# Altium schematic sheet Power.SchDoc
size 393 x 350 mm; SheetNumber: 2; SheetTotal: 7
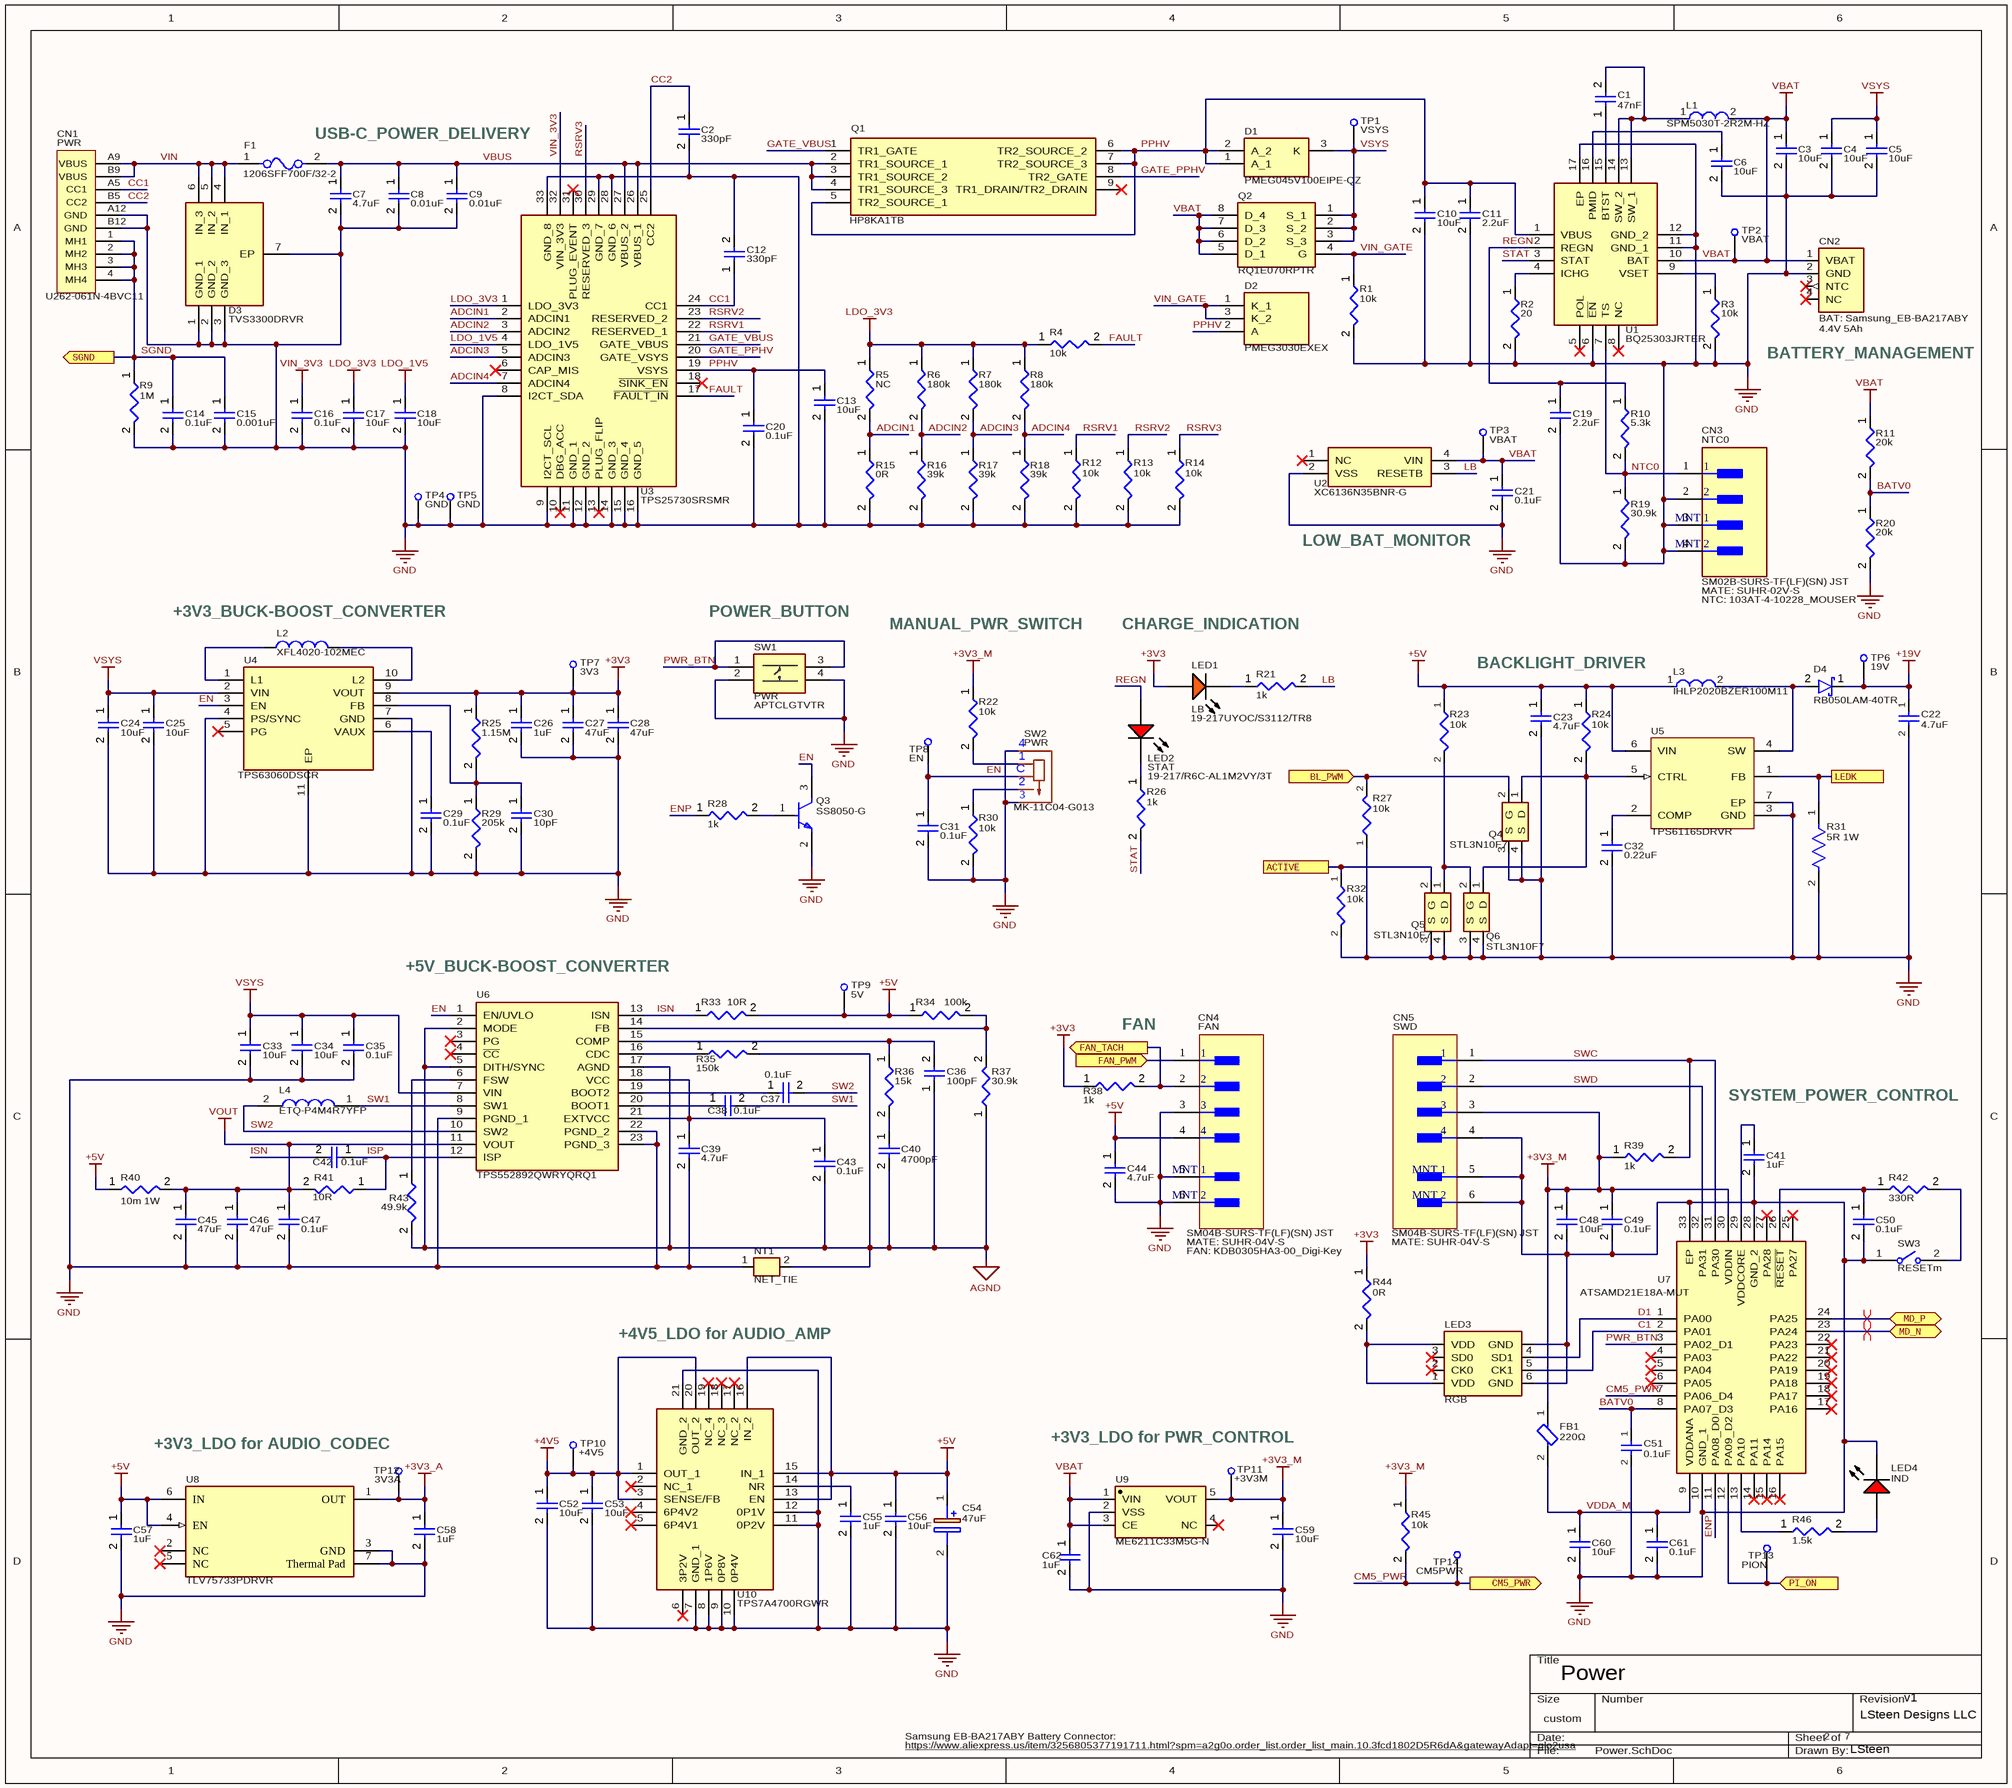
[diagram p0: Power.SchDoc]

## Parts
C1  47nF  [CAPC1005X56X25LL10T15]
C2  330pF  [CAPC1005X56X25LL10T15]
C3  10uF  [CAPC0805(2012)145_L]
C4  10uF  [CAPC0805(2012)145_L]
C5  10uF  [CAPC0805(2012)145_L]
C6  10uF  [CAPC0805(2012)145_L]
C7  4.7uF  [CAPC0603(1608)100_L]
C8  0.01uF  [CAPC1005X56X25LL10T15]
C9  0.01uF  [CAPC1005X56X25LL10T15]
C10  10uF  [CAPC0805(2012)145_L]
C11  2.2uF  [CAPC0603(1608)100_L]
C12  330pF  [CAPC1005X56X25LL10T15]
C13  10uF  [CAPC0603(1608)100_L]
C14  0.1uF  [CAPC1005X56X25LL10T15]
C15  0.001uF  [CAPC1005X56X25LL10T15]
C16  0.1uF  [CAPC1005X56X25LL10T15]
C17  10uF  [CAPC0603(1608)100_L]
C18  10uF  [CAPC0603(1608)100_L]
C19  2.2uF  [CAPC1005X56X25LL10T15]
C20  0.1uF  [CAPC1005X56X25LL10T15]
C21  0.1uF  [CAPC1005X56X25LL10T15]
C22  4.7uF  [CAPC2012X140N]
C23  4.7uF  [CAPC0805(2012)145_L]
C24  10uF  [CAPC0603(1608)100_L]
C25  10uF  [CAPC0603(1608)100_L]
C26  1uF  [CAPC1005X56X25LL10T15]
C27  47uF  [CAPC0805(2012)145_L]
C28  47uF  [CAPC0805(2012)145_L]
C29  0.1uF  [CAPC1005X56X25LL10T15]
C30  10pF  [CAPC1005X56X25LL10T15]
C31  0.1uF  [CAPC1005X56X25LL10T15]
C32  0.22uF  [CAPC1005X56X25LL10T15]
C33  10uF  [CAPC0805(2012)145_L]
C34  10uF  [CAPC0805(2012)145_L]
C35  0.1uF  [CAPC1005X56X25LL10T15]
C36  100pF  [CAPC1005X56X25LL10T15]
C37  0.1uF  [CAPC1005X56X25LL10T15]
C38  0.1uF  [CAPC1005X56X25LL10T15]
C39  4.7uF  [CAPC0603(1608)100_L]
C40  4700pF  [CAPC1005X56X25LL10T15]
C41  1uF  [CAPC1005X56X25LL10T15]
C42  0.1uF  [CAPC1005X56X25LL10T15]
C43  0.1uF  [CAPC1005X56X25LL10T15]
C44  4.7uF  [CAPC0805(2012)145_L]
C45  47uF  [CAPC0805(2012)145_L]
C46  47uF  [CAPC0805(2012)145_L]
C47  0.1uF  [CAPC1005X56X25LL10T15]
C48  10uF  [CAPC0603(1608)100_L]
C49  0.1uF  [CAPC1005X56X25LL10T15]
C50  0.1uF  [CAPC1005X56X25LL10T15]
C51  0.1uF  [CAPC1005X55N]
C52  10uF  [CAPC0805(2012)145_L]
C53  10uF  [CAPC0805(2012)145_L]
C54  47uF  [CAPPM2014X140N]
C55  1uF  [CAPC0603(1608)100_L]
C56  10uF  [CAPC0805(2012)145_L]
C57  1uF  [CAPC0603(1608)100_L]
C58  1uF  [CAPC0603(1608)100_L]
C59  10uF  [CAPC0603(1608)100_L]
C60  10uF  [CAPC0603(1608)100_L]
C61  0.1uF  [CAPC1005X56X25LL10T15]
C62  1uF  [CAPC0603(1608)100_L]
CN1  PWR  [USB-SMD_U262-061N-4BVC11]
CN2  BAT  [BAT_SS_EB-BA217ABY_BRD]  (value not drawn)
CN3  NTC0  [FP-SM02B-SURS-TF_LF_SN-MFG]
CN4  FAN  [FP-SM04B-SURS-TF_LF_SN-MFG]
CN5  SWD  [FP-SM04B-SURS-TF_LF_SN-MFG]
D1  PMEG045V100EIPE-QZ  [PMEG045V100EIPEQZ]
D2  PMEG3030EXEX  [PMEG4010EXEX]
D3  TVS3300DRVR  [SON65P200X200X80-7N]
D4  RB050LAM-40TR  [SODFL4725X105N]
F1  1206SFF700F/32-2  [FP-1206SFF-MFG]
FB1  220Ω  [FP-BLM18-0_15-t0_5-IPC_B]
L1  SPM5030T-2R2M-HZ  [FP-SPM5030-MFG]
L2  XFL4020-102MEC  [COIL-XFL4020_V]
L3  IHLP2020BZER100M11  [FP-IHLP-2020BZ-FP_1_905x2-MFG]
L4  ETQ-P4M4R7YFP  [ETQP3M_4M_YFP]
LED1  LB  [LED_0603]
LED2  STAT  [EVRL-0603-2_V]
LED3  RGB  [AP102-2020]
LED4  IND  [EVRL-0603-2_V]
NT1  NET_TIE  [NET_TIE1]  (net tie, no BOM)
Q1  HP8KA1TB  [HP8KA1TB]
Q2  RQ1E070RPTR  [RQ1E070RPTR]
Q3  SS8050-G  [FP-SS8050-G-MFG]
Q4  STL3N10F7  [STL3N10F7]
Q5  STL3N10F7  [STL3N10F7]
Q6  STL3N10F7  [STL3N10F7]
R1  10k  [RESC0402(1005)_L]
R2  20  [RESC0402(1005)_L]
R3  10k  [RESC0402(1005)_L]
R4  10k  [RESC0402(1005)_L]
R5  NC  [RESC0402(1005)_L]
R6  180k  [RESC0402(1005)_L]
R7  180k  [RESC0402(1005)_L]
R8  180k  [RESC0402(1005)_L]
R9  1M  [RESC0402(1005)_L]
R10  5.3k  [RESC0402(1005)_L]
R11  20k  [RESC0402(1005)_L]
R12  10k  [RESC0402(1005)_L]
R13  10k  [RESC0402(1005)_L]
R14  10k  [RESC0402(1005)_L]
R15  0R  [RESC0402(1005)_L]
R16  39k  [RESC0402(1005)_L]
R17  39k  [RESC0402(1005)_L]
R18  39k  [RESC0402(1005)_L]
R19  30.9k  [RESC0402(1005)_L]
R20  20k  [RESC0402(1005)_L]
R21  1k  [RESC0402(1005)_L]
R22  10k  [RESC0402(1005)_L]
R23  10k  [ERA2AED122X]
R24  10k  [RESC0402(1005)_L]
R25  1.15M  [RESC0402(1005)_L]
R26  1k  [RESC0402(1005)_L]
R27  10k  [ERA2AED122X]
R28  1k  [RESC0402(1005)_L]
R29  205k  [RESC0402(1005)_L]
R30  10k  [RESC0402(1005)_L]
R31  5R 1W  [FP-CRCW2512-e3-MFG]
R32  10k  [ERA2AED122X]
R33  10R  [RESC0402(1005)_L]
R34  100k  [RESC0402(1005)_L]
R35  150k  [RESC0402(1005)_L]
R36  15k  [RESC0402(1005)_L]
R37  30.9k  [RESC0402(1005)_L]
R38  1k  [RESC0402(1005)_L]
R39  1k  [RESC0402(1005)_L]
R40  10m 1W  [RESC3216X60X45ML15T20]
R41  10R  [RESC0402(1005)_L]
R42  330R  [RESC0402(1005)_L]
R43  49.9K  [RESC0402(1005)_L]
R44  0R  [RESC0402(1005)_L]
R45  10k  [RESC0402(1005)_L]
R46  1.5k  [RESC0402(1005)_L]
SW1  PWR  [APTCLGTVTR]
SW2  PWR  [SW-SMD_MK-11C04-G013]
SW3  RESETm  [FP-B3U-1000P-MFG]
TP1  VSYS  [TP]  (no BOM)
TP2  VBAT  [TP]  (no BOM)
TP3  VBAT  [TP]  (no BOM)
TP4  GND  [TP]  (no BOM)
TP5  GND  [TP]  (no BOM)
TP6  19V  [TP]  (no BOM)
TP7  3V3  [TP]  (no BOM)
TP8  EN  [TP]  (no BOM)
TP9  5V  [TP]  (no BOM)
TP10  +4V5  [TP]  (no BOM)
TP11  +3V3M  [TP]  (no BOM)
TP12  3V3A  [TP]  (no BOM)
TP13  PION  [TP]  (no BOM)
TP14  CM5PWR  [TP]  (no BOM)
U1  BQ25303JRTER  [QFN50P300X300X80-17N-D]
U2  XC6136N35BNR-G  [XC6136C12ANRG]
U3  TPS25730SRSMR  [QFN40P400X400X100-33N-D]
U4  TPS63060DSCR  [SON50P300X300X80-11N-D]
U5  TPS61165DRVR  [DRV0006A_V]
U6  TPS552892QWRYQRQ1  [TPS552892QWRYQRQ1]
U7  ATSAMD21E18A-MUT  [QFN50P500X500X90-33N-D]
U8  TLV75733PDRVR  [FP-DRV0006A-IPC_B]
U9  ME6211C33M5G-N  [SOT95P270X145-5N]
U10  TPS7A4700RGWR  [QFN65P500X500X100-21N-D]

## Ports
ACTIVE (see Display[4B]), BL_PWM (in, see Module A IO[6B]), CM5_PWR (out, see Module A IO[4A]), FAN_PWM (in, see Module A IO[5B]), FAN_TACH (out, see Module A IO[5B]), LEDK (see Display[2A]), MD_N (bidir, see USB[2D]), MD_P (bidir, see USB[2D]), PI_ON (in, see Module A IO[5B]), SGND (out, see Module B High-Speed[6C])

## Nets
+3V3: C26.1 C27.1 C28.1 LED1.1(A) R25.1 R38.1 R44.1 TP7.1 U4.9(VOUT)
+3V3_A: C58.1 TP12.1 U8.1(OUT)
+3V3_M: C48.1 C49.1 C59.1 CN5.3 FB1.1 R22.1 R39.1 R45.1 TP11.1 U7.30(VDDIN) U9.5(VOUT)
+4V5: C52.1 C53.1 TP10.1 U10.1(OUT_1) U10.3(SENSE/FB) U10.20(OUT_2)
+5V: C23.1 C44.1 C54.1(+) C56.1 C57.1 CN4.4 L3.1 R23.1 R24.1 R33.2 R34.1 R40.1 TP9.1 U5.6(VIN) U8.4(EN) U8.6(IN) U10.13(EN) U10.15(IN_1) U10.16(IN_2)
+19V: C22.1 D4.1 TP6.1
AGND: C36.1 C40.2 C43.2 NT1.2 R35.2 R37.1 R43.2 U6.2(MODE) U6.5(DITH/SYNC) U6.17(AGND)
GND: C2.2 C3.2 C4.2 C5.2 C6.2 C7.2 C8.2 C9.2 C10.2 C11.2 C12.2 C13.2 C14.2 C15.2 C16.2 C17.2 C18.2 C19.2 C20.2 C21.2 C22.2 C23.2 C24.2 C25.2 C26.2 C27.2 C28.2 C29.2 C30.2 C31.2 C32.2 C33.2 C34.2 C35.2 C39.2 C41.2 C44.2 C45.2 C46.2 C47.2 C48.2 C49.2 C50.2 C51.2 C52.2 C53.2 C54.2(-) C55.2 C56.2 C57.2 C58.2 C59.2 C60.2 C61.2 C62.2 CN1.A12(GND) CN1.B12(GND) CN2.2(GND) CN3.2 CN3.3(MNT_1) CN3.4(MNT_2) CN4.3 CN4.5(MNT_1) CN4.6(MNT_2) CN5.4 CN5.5(MNT_1) CN5.6(MNT_2) D3.1(GND_1) D3.2(GND_2) D3.3(GND_3) D3.7(EP) LED3.6(GND) LED3.8(GND) LED4.2(K) NT1.1 Q3.2(E) Q4.3(S) Q4.4(S) Q5.3(S) Q5.4(S) Q6.3(S) Q6.4(S) R1.2 R2.2 R3.2 R9.2 R12.2 R13.2 R14.2 R15.2 R16.2 R17.2 R18.2 R19.2 R20.2 R27.1 R29.2 R30.2 R31.2 R32.2 SW1.2 SW1.4 SW2.3(NC) SW2.4 SW3.1 TP4.1 TP5.1 U1.6(~{EN}) U1.11(GND_1) U1.12(GND_2) U1.17(EP) U2.2(VSS) U3.8(I2CT_SDA) U3.9(I2CT_SCL) U3.11(GND_1) U3.12(GND_2) U3.14(GND_3) U3.15(GND_4) U3.16(GND_5) U3.28(GND_6) U3.29(GND_7) U3.33(GND_8) U4.4(PS/SYNC) U4.7(GND) U4.11(EP) U5.3(GND) U5.7(EP) U6.9(PGND_1) U6.22(PGND_2) U6.23(PGND_3) U7.10(GND_1) U7.28(GND_2) U7.33(EP) U8.3(GND) U8.7(Thermal_Pad) U9.2(VSS) U10.7(GND_1) U10.8(1P6V) U10.9(0P8V) U10.10(0P4V) U10.11(0P2V) U10.12(0P1V) U10.21(GND_2)
LDO_1V5: C18.1 U3.4(LDO_1V5)
LDO_3V3: C17.1 R4.1 R5.1 R6.1 R7.1 R8.1 U3.1(LDO_3V3)
VBAT: C3.1 C21.1 C62.1 CN2.1(VBAT) L1.2 Q2.5(D_1) Q2.6(D_2) Q2.7(D_3) Q2.8(D_4) R11.1 TP2.1 TP3.1 U1.10(BAT) U2.4(VIN) U9.1(VIN) U9.3(CE)
VIN_3V3: C16.1 U3.32(VIN_3V3)
VOUT: C45.1 C46.1 C47.1 R40.2 R41.2 U6.11(VOUT)
VSYS: C4.1 C5.1 C24.1 C25.1 C33.1 C34.1 C35.1 D1.3(K) Q2.1(S_1) Q2.2(S_2) Q2.3(S_3) TP1.1 U4.2(VIN) U6.7(VIN)
ACTIVE: Q5.2(G) R32.1 ; port ACTIVE
ADCIN1: R5.2 R15.1 U3.2(ADCIN1)
ADCIN2: R6.2 R16.1 U3.3(ADCIN2)
ADCIN3: R7.2 R17.1 U3.5(ADCIN3)
ADCIN4: R8.2 R18.1 U3.7(ADCIN4)
BATV0: C51.1 R11.2 R20.1 U7.8(PA07_D3)
BL_PWM: Q4.2(G) R27.2 ; port BL_PWM
C1: LED3.5(CK1) U7.2(PA01)
CC1: C12.1 CN1.A5(CC1) U3.24(CC1)
CC2: C2.1 CN1.B5(CC2) U3.25(CC2)
CM5_PWR: R45.2 TP14.1 U7.7(PA06_D4) ; port CM5_PWR
D1: LED3.4(SD1) U7.1(PA00)
EN: C31.1 Q3.3(C) SW2.C TP8.1 U4.3(EN) U6.1(EN/UVLO)
ENP: R28.1 U7.11(PA08_D0)
FAN_PWM: CN4.1 ; port FAN_PWM
FAN_TACH: CN4.2 R38.2 ; port FAN_TACH
FAULT: R4.2 U3.17(~{FAULT_IN})
GATE_PPHV: Q1.8(TR2_GATE) U3.20(GATE_VSYS)
GATE_VBUS: Q1.1(TR1_GATE) U3.21(GATE_VBUS)
ISN: C42.2 R33.1 U6.13(ISN)
ISP: C42.1 R41.1 U6.12(ISP)
LB: R21.2 U2.3(RESETB)
LEDK: R31.1 U5.1(FB) ; port LEDK
MD_N: U7.23(PA24) ; port MD_N
MD_P: U7.24(PA25) ; port MD_P
NTC0: CN3.1 R10.2 R19.1 U1.7(TS)
PI_ON: TP13.1 U7.12(PA09_D2) ; port PI_ON
PPHV: C10.1 C11.1 C13.1 C20.1 D1.1(A_1) D1.2(A_2) D2.2(A) Q1.5(TR2_SOURCE_1) Q1.6(TR2_SOURCE_2) Q1.7(TR2_SOURCE_3) U1.1(VBUS) U3.19(VSYS)
PWR_BTN: SW1.1 SW1.3 U7.3(PA02_D1)
REGN: C19.1 LED2.1(A) R10.1 U1.2(REGN)
RSRV1: R12.1 U3.22(RESERVED_1)
RSRV2: R13.1 U3.23(RESERVED_2)
RSRV3: R14.1 U3.30(RESERVED_3)
SGND: C14.1 C15.1 CN1.1(MH1) CN1.2(MH2) CN1.3(MH3) CN1.4(MH4) R9.1 ; port SGND
STAT: R26.2 U1.3(STAT)
SW1: C38.2 L4.1 U6.8(SW1)
SW2: C37.2 L4.2 U6.10(SW2)
SWC: CN5.1 R39.2 U7.31(PA30)
SWD: CN5.2 U7.32(PA31)
VBUS: C7.1 C8.1 C9.1 F1.2 Q1.2(TR1_SOURCE_1) Q1.3(TR1_SOURCE_2) Q1.4(TR1_SOURCE_3) U3.26(VBUS_1) U3.27(VBUS_2)
VDDA_M: C60.1 C61.1 FB1.2 U7.9(VDDANA)
VIN: CN1.A9(VBUS) CN1.B9(VBUS) D3.4(IN_1) D3.5(IN_2) D3.6(IN_3) F1.1
VIN_GATE: D2.1(K_1) D2.3(K_2) Q2.4(G) R1.1
NetC1_1: C1.1 U1.15(BTST)
NetC1_2: C1.2 L1.1 U1.13(SW_1) U1.14(SW_2)
NetC6_1: C6.1 U1.16(PMID)
NetC29_1: C29.1 U4.6(VAUX)
NetC30_1: C30.1 R25.2 R29.1 U4.8(FB)
NetC32_1: C32.1 U5.2(COMP)
NetC36_2: C36.2 R36.1 U6.15(COMP)
NetC37_1: C37.1 U6.19(BOOT2)
NetC38_1: C38.1 U6.20(BOOT1)
NetC39_1: C39.1 C43.1 U6.18(VCC) U6.21(EXTVCC)
NetC40_1: C40.1 R36.2
NetC41_1: C41.1 U7.29(VDDCORE)
NetC50_1: C50.1 R42.1 U7.26(~{RESET})
NetC55_1: C55.1 U10.14(NR)
NetD4_2: D4.2 L3.2 U5.4(SW)
NetL2_1: L2.1 U4.1(L1)
NetL2_2: L2.2 U4.10(L2)
NetLED1_2: LED1.2(K) R21.1
NetLED2_2: LED2.2(K) R26.1
NetLED3_1: LED3.1(VDD) LED3.7(VDD) R44.2
NetLED4_1: LED4.1(A) R46.2
NetQ3_1: Q3.1(B) R28.2
NetQ4_1: Q4.1(D) Q6.1(D) R24.2 U5.5(CTRL)
NetQ5_1: Q5.1(D) Q6.2(G) R23.2
NetR2_1: R2.1 U1.4(ICHG)
NetR3_1: R3.1 U1.9(VSET)
NetR22_2: R22.2 SW2.1
NetR30_1: R30.1 SW2.2
NetR34_2: R34.2 R37.2 U6.14(FB)
NetR35_1: R35.1 U6.16(CDC)
NetR42_2: R42.2 SW3.2
NetR43_1: R43.1 U6.6(FSW)
NetR46_1: R46.1 U7.13(PA10)

Not connected (* = marked no-connect by the designer): CN2 3(NTC)* 4(NC)*; LED3 2(CK0)* 3(SD0)*; Q1 9(TR1_DRAIN/TR2_DRAIN)*; U1 5(POL)* 8(NC)*; U2 1(NC)*; U3 6(CAP_MIS)* 10(DBG_ACC)* 13(PLUG_FLIP)* 18(~{SINK_EN})* 31(PLUG_EVENT)*; U4 5(PG)*; U6 3(PG)* 4(~{CC})*; U7 4(PA03)* 5(PA04)* 6(PA05)* 14(PA11)* 15(PA14)* 16(PA15)* 17(PA16)* 18(PA17)* 19(PA18)* 20(PA19)* 21(PA22)* 22(PA23)* 25(PA27)* 27(PA28)*; U8 2(NC)* 5(NC)*; U9 4(NC)*; U10 2(NC_1)* 4(6P4V2)* 5(6P4V1)* 6(3P2V)* 17(NC_2)* 18(NC_3)* 19(NC_4)*

## Layout directives
differential pair; differential pair class USB 2.0: MD_N, MD_P

## Notes on the sheet
- (near F1) USB-C_POWER_DELIVERY
- (near CN1) U262-061N-4BVC11
- (near CN2) BAT: Samsung_EB-BA217ABY
- BATTERY_MANAGEMENT
- (near CN2) 4.4V 5Ah
- LOW_BAT_MONITOR
- (near CN3) SM02B-SURS-TF(LF)(SN) JST
- (near L2) +3V3_BUCK-BOOST_CONVERTER
- (near SW1) POWER_BUTTON
- MANUAL_PWR_SWITCH
- CHARGE_INDICATION
- NTC: 103AT-4-10228_MOUSER
- (near CN3) MATE: SUHR-02V-S
- (near SW1) APTCLGTVTR
- BACKLIGHT_DRIVER
- (near R26) 19-217/R6C-AL1M2VY/3T
- 19-217UYOC/S3112/TR8
- (near SW2) MK-11C04-G013
- (near U6) +5V_BUCK-BOOST_CONVERTER
- FAN
- (near C41) SYSTEM_POWER_CONTROL
- FAN: KDB0305HA3-00_Digi-Key
- (near CN4) MATE: SUHR-04V-S
- (near CN4) SM04B-SURS-TF(LF)(SN) JST
- MATE: SUHR-04V-S
- (near CN5) SM04B-SURS-TF(LF)(SN) JST
- +4V5_LDO for AUDIO_AMP
- +3V3_LDO for AUDIO_CODEC
- (near TP11) +3V3_LDO for PWR_CONTROL
- Power
- Samsung EB-BA217ABY Battery Connector:
- 2
- 7
- LSteen Designs LLC
- v1
- https://www.aliexpress.us/item/3256805377191711.html?spm=a2g0o.order_list.order_list_main.10.3fcd1802D5R6dA&gatewayAdapt=glo2usa
- LSteen

## Library data of the parts
C1 = CMP-001-00001-6: Chip Capacitor, 47 nF, +/- 5%, 16 V, 0402 (1005 Metric); Capacitor Type: Ceramic; Voltage Rating: 16V; Max Operating Temperature: 125°C; Min Operating Temperature: -55°C; Case/Package: 0402; Value: 47nF; Mounting Technology: SM; Pins: 2; Tolerance: 5%; RoHS Compliant: True
C2 C12 = CMP-001-00001-6: Chip Capacitor, 330pF, +/- 5%, 16 V, 0402 (1005 Metric); Capacitor Type: Ceramic; Voltage Rating: 16V; Max Operating Temperature: 125°C; Min Operating Temperature: -55°C; Case/Package: 0402; Value: 330pF; Mounting Technology: SM; Pins: 2; Tolerance: 5%; RoHS Compliant: True
C3-C6 C10 C33 C34 C52 C53 C56 = CMP-001-00079-4: Chip Capacitor, 10µF +/-20%, 25V, 0805, Thickness 1.45 mm; Tolerance: 10%; Max Operating Temperature: 85°C; Value: 10µF; Case/Package: 0805; Voltage Rating: 25V; Min Operating Temperature: -55°C; Mounting Technology: SMT; Pins: 2
C7 = CMP-001-00076-4: Chip Capacitor, 4.7uF +/-20%, 10V, 0603, Thickness 1 mm; Tolerance: 10%; Mounting Technology: SMT; Case/Package: 0603; Pins: 2; Min Operating Temperature: -55°C; Max Operating Temperature: 85°C; Value: 4.7uF; Voltage Rating: 10V
C8 C9 = CMP-001-00001-6: Chip Capacitor, 0.01 uF, +/- 5%, 16 V, 0402 (1005 Metric); Capacitor Type: Ceramic; Voltage Rating: 16V; Max Operating Temperature: 125°C; Min Operating Temperature: -55°C; Case/Package: 0402; Value: 0.01uF; Mounting Technology: SM; Pins: 2; Tolerance: 5%; RoHS Compliant: True
C11 = CMP-001-00076-4: Chip Capacitor, 2.2uF +/-20%, 10V, 0603, Thickness 1 mm; Tolerance: 10%; Mounting Technology: SMT; Case/Package: 0603; Pins: 2; Min Operating Temperature: -55°C; Max Operating Temperature: 85°C; Value: 2.2uF; Voltage Rating: 10V
C13 C17 C18 C24 C25 C48 C59 C60 = CMP-001-00076-4: Chip Capacitor, 10uF +/-20%, 10V, 0603, Thickness 1 mm; Tolerance: 10%; Mounting Technology: SMT; Case/Package: 0603; Pins: 2; Min Operating Temperature: -55°C; Max Operating Temperature: 85°C; Value: 10uF; Voltage Rating: 10V
C14 C16 C20 C21 C29 C31 C35 C37 C38 C42 C43 C47 C49 C50 C61 = CMP-001-00001-6: Chip Capacitor, 0.1 uF, +/- 5%, 16 V, 0402 (1005 Metric); Capacitor Type: Ceramic; Voltage Rating: 16V; Max Operating Temperature: 125°C; Min Operating Temperature: -55°C; Case/Package: 0402; Value: 0.1uF; Mounting Technology: SM; Pins: 2; Tolerance: 5%; RoHS Compliant: True
C15 = CMP-001-00001-6: Chip Capacitor, 0.1 uF, +/- 5%, 16 V, 0402 (1005 Metric); Capacitor Type: Ceramic; Value: 0.1uF; Voltage Rating: 16V; Max Operating Temperature: 125°C; Min Operating Temperature: -55°C; Case/Package: 0402; Mounting Technology: SM; Pins: 2; Tolerance: 5%; RoHS Compliant: True
C19 = CMP-001-00001-6: Chip Capacitor, 2.2uF uF, +/- 5%, 16 V, 0402 (1005 Metric); Capacitor Type: Ceramic; Voltage Rating: 16V; Max Operating Temperature: 125°C; Min Operating Temperature: -55°C; Case/Package: 0402; Value: 2.2uF; Mounting Technology: SM; Pins: 2; Tolerance: 5%; RoHS Compliant: True
C22 = C0805: Height: 1.4mm
C23 C44 = CMP-001-00079-4: Chip Capacitor, 4.7µF +/-20%, 25V, 0805, Thickness 1.45 mm; Tolerance: 10%; Max Operating Temperature: 85°C; Value: 4.7µF; Case/Package: 0805; Voltage Rating: 25V; Min Operating Temperature: -55°C; Mounting Technology: SMT; Pins: 2
C26 C41 = CMP-001-00001-6: Chip Capacitor, 1 uF, +/- 5%, 16 V, 0402 (1005 Metric); Capacitor Type: Ceramic; Voltage Rating: 16V; Max Operating Temperature: 125°C; Min Operating Temperature: -55°C; Case/Package: 0402; Value: 1uF; Mounting Technology: SM; Pins: 2; Tolerance: 5%; RoHS Compliant: True
C27 C28 = CMP-001-00079-4: Chip Capacitor, 47µF +/-20%, 25V, 0805, Thickness 1.45 mm; Tolerance: 10%; Max Operating Temperature: 85°C; Value: 47µF; Case/Package: 0805; Voltage Rating: 25V; Min Operating Temperature: -55°C; Mounting Technology: SMT; Pins: 2
C30 = CMP-001-00001-6: Chip Capacitor, 10 pF, +/- 5%, 16 V, 0402 (1005 Metric); Capacitor Type: Ceramic; Voltage Rating: 16V; Max Operating Temperature: 125°C; Min Operating Temperature: -55°C; Case/Package: 0402; Value: 10pF; Mounting Technology: SM; Pins: 2; Tolerance: 5%; RoHS Compliant: True
C32 = CMP-001-00001-6: Chip Capacitor, 0.22 uF, +/- 5%, 16 V, 0402 (1005 Metric); Capacitor Type: Ceramic; Voltage Rating: 16V; Max Operating Temperature: 125°C; Min Operating Temperature: -55°C; Case/Package: 0402; Value: 0.22uF; Mounting Technology: SM; Pins: 2; Tolerance: 5%; RoHS Compliant: True
C36 = CMP-001-00001-6: Chip Capacitor, 100 pF, +/- 5%, 16 V, 0402 (1005 Metric); Capacitor Type: Ceramic; Voltage Rating: 16V; Max Operating Temperature: 125°C; Min Operating Temperature: -55°C; Case/Package: 0402; Value: 100pF; Mounting Technology: SM; Pins: 2; Tolerance: 5%; RoHS Compliant: True
C39 = CMP-001-00076-4: Chip Capacitor, 4.7µF +/-20%, 10V, 0603, Thickness 1 mm; Tolerance: 10%; Mounting Technology: SMT; Case/Package: 0603; Pins: 2; Min Operating Temperature: -55°C; Max Operating Temperature: 85°C; Value: 4.7µF; Voltage Rating: 10V
C40 = CMP-001-00001-6: Chip Capacitor, 4700 pF, +/- 5%, 16 V, 0402 (1005 Metric); Capacitor Type: Ceramic; Voltage Rating: 16V; Max Operating Temperature: 125°C; Min Operating Temperature: -55°C; Case/Package: 0402; Value: 4700pF; Mounting Technology: SM; Pins: 2; Tolerance: 5%; RoHS Compliant: True
C45 C46 = CMP-001-00082-4: Chip Capacitor, 47µF +/-40%, 6.3V, 0805, Thickness 1.45 mm; Tolerance: 10%; Min Operating Temperature: -55°C; Max Operating Temperature: 85°C; Case/Package: 0805; Value: 47µF; Pins: 2; Mounting Technology: SMT; Voltage Rating: 6.3V
C51 = C0402: Height: 0.55mm
C54 = TLJR476M010R3200: Tantalum TLJR476M010R3200; Manufacturer_Name: Kyocera AVX; Datasheet Link: https://componentsearchengine.com/Datasheets/1/TLJR476M010R3200.pdf; Height: 1.4mm; Manufacturer_Part_Number: TLJR476M010R3200; Mouser Part Number: 581-TLJR476M10R3200; Mouser Price/Stock: https://www.mouser.co.uk/ProductDetail/AVX/TLJR476M010R3200?qs=WRdLm8viVpRFTfIUy8OazQ%3D%3D; Arrow Part Number: TLJR476M010R3200; Arrow Price/Stock: https://www.arrow.com/en/products/tljr476m010r3200/avx
C55 C57 C58 C62 = CMP-001-00076-4: Chip Capacitor, 1uF +/-20%, 10V, 0603, Thickness 1 mm; Tolerance: 10%; Mounting Technology: SMT; Case/Package: 0603; Pins: 2; Min Operating Temperature: -55°C; Max Operating Temperature: 85°C; Value: 1uF; Voltage Rating: 10V
CN1 = U262-061N-4BVC11: USB-C Connector; Manufacturer_Name: XKB Connection; Manufacturer_Part_Number: U262-061N-4BVC11; LCSC Part Number: C2764612; Supplier 1: LCSC
CN2 = BAT_SS_EB-BA217ABY_BRD: Samsung battery connector; System: Connector
CN3 = CMP-17439-000279-1: LCSC_CONN HEADER SMD R/A 2POS 0.8MM; Number of Contacts: 2; Working Voltage: 30V; Wire/Cable Gauge: 32AWG; Gender: Male; Body Plating: Tin; Current Rating: 500mA; Lead Pitch: 0.8mm; Color: Natural; Min Operating Temperature: -25°C; Insulation Material: Nylon; Number of Rows: 1; Flammability Rating: UL94 V-0; Number of Positions: 2; Contact Shape: Rectangular; Orientation: Horizontal; Contact Material: Copper Alloy; Fastening Type: Pull; Max Operating Temperature: 85°C; Termination: Solder; Contact Type: Outer Shroud Contact; Series: SUR; Insulation Color: Natural; Packaging: Cut Tape; Contact Finish - Mating: TIN; REACH SVHC: No SVHC; Pitch: 0.8mm; Contact Plating: Tin; Lead Free: Lead Free; Voltage Rating: 30V; Mount: Surface Mount; Connector Type: Header; Number of Poles: 2; Material: Polyamide
CN4 CN5 = CMP-17439-000307-2: CONN HEADER SMD R/A 4POS 0.8MM; NexarPartId: 2647826; Gender: Male; Working Voltage: 30V; Number of Poles: 4; Body Plating: Tin; Wire/Cable Gauge: 32AWG; Current Rating: 500mA; Termination: IDC; Material: Polyamide; Contact Plating: Tin; REACH SVHC: No SVHC; Max Operating Temperature: 85°C; Min Operating Temperature: -25°C; Flammability Rating: UL94 V-0; Number of Rows: 1; Contact Material: Tin; Number of Contacts: 4; Case/Package: SMD/SMT; Voltage Rating: 30V; Lead Pitch: 800µm; Lead Free: Lead Free; Height: 1.75mm; RoHS: Compliant; Voltage Rating (DC): 30V
D1 = PMEG045V100EIPE-QZ: Schottky Diode; Manufacturer_Name: Nexperia; Datasheet Link: https://assets.nexperia.com/documents/data-sheet/PMEG045V100EIPE-Q.pdf; Height: 0.99mm; Manufacturer_Part_Number: PMEG045V100EIPE-QZ; Mouser Part Number: 771-MEG045V100EIPEQZ; Mouser Price/Stock: https://www.mouser.co.uk/ProductDetail/Nexperia/PMEG045V100EIPE-QZ?qs=vvQtp7zwQdN%252BeVHHcFKyew%3D%3D; Supplier 1: Mouser; Supplier Part Number 1: 771-PMEG045V100EIPEZ
D2 = PMEG3030EXEX: Schottky Diode; Manufacturer_Name: Nexperia; Datasheet Link: https://assets.nexperia.com/documents/data-sheet/PMEG4010EXE.pdf; Height: 1mm; Manufacturer_Part_Number: PMEG3030EXEX; Supplier 1: Mouser; Supplier Part Number 1: 771-PMEG3030EXEX
D3 = TVS3300DRVR: Integrated Circuit; Manufacturer_Name: Texas Instruments; Datasheet Link: http://www.ti.com/lit/ds/symlink/tvs3300.pdf; Height: 0.8mm; Manufacturer_Part_Number: TVS3300DRVR; Mouser Part Number: 595-TVS3300DRVR; Mouser Price/Stock: https://www.mouser.co.uk/ProductDetail/Texas-Instruments/TVS3300DRVR?qs=Mv7BduZupUi7J6BLZ4hOYw%3D%3D; Arrow Part Number: TVS3300DRVR; Arrow Price/Stock: https://www.arrow.com/en/products/tvs3300drvr/texas-instruments?region=nac
D4 = RB050LAM-40TR: Schottky Diode; Manufacturer_Name: ROHM Semiconductor; Datasheet Link: https://fscdn.rohm.com/en/products/databook/datasheet/discrete/diode/schottky_barrier/rb050lam-40tr-e.pdf; Height: 1.05mm; Manufacturer_Part_Number: RB050LAM-40TR; Mouser Part Number: 755-RB050LAM-40TR; Mouser Price/Stock: https://www.mouser.co.uk/ProductDetail/ROHM-Semiconductor/RB050LAM-40TR?qs=gt1LBUVyoHlwe%2FI5DePODg%3D%3D; Supplier 1: Mouser; Supplier Part Number 1: 755-RB050LAM-40TR
F1 = CMP-08605-000023-1: FUSE BOARD MOUNT 7A 24VDC 1206; Manufacturer: Littelfuse; Fuse I2T: 1.75A2Sec; Max Fuse Dc Voltage: 32V; Fuse Blow Speed: Fast; Fuse Interrupt Dc Current: 50A; Resistance: 0.011Ω; Value: 0.011Ω; Height: 1.3mm; Automotive: No; Manufacturer Part Number: 1206SFF700F/32-2; Octopart: https://octopart.com/1206sff700f%2F32-2-littelfuse-74214425; Fuse Current: 7A; ComponentLink2Description: Datasheet; Device Class L1: Circuit Protection; Lead Free: Yes; Temperature: -55°C to +125°C; Temperature Range High: +125°C; Device Class L2: Fuses; Category: Fuse; ComponentLink2URL: https://www.littelfuse.com/~/media/electronics/datasheets/fuses/littelfuse_fuse_sff_datasheet.pdf.pdf; Ipc Land Pattern Name: CAPC320160X110; Temperature Range Low: -55°C; RoHS: TRUE; Digikey Description: FUSE BOARD MOUNT 7A 24VDC 1206; Package: 1206SFF; Device Class L3: unset
FB1 = CMP-06046-002311-1: Chip Ferrite Bead, 0603, 220Ω @ 100MHz, 25%, 0.04Ω, 2.5A; RoHS Compliant: Yes
L1 = CMP-08253-000410-1: FIXED IND 2.2UH 8.5A 21.23 MOHM; Saturation Current: 3.6A; Tolerance: 20%; DC Resistance (DCR): 21.23mR; Test Frequency: 100kHz; Shielding: Shielded; Core Material: Metal; Series: SPM-HZ; Packaging: Cut Tape; Mount: Surface Mount; Ratings: AEC-Q200; Inductance: 2.2uH; Max Operating Temperature: 125°C; RoHS Compliant: Yes; Case/Package: Nonstandard; Min Operating Temperature: -40°C
L2 = CMP-2000-07423-1: Shielded Power Inductor, 1 uH, 64 MHz, -40 to 125 degC, 2-Pin SMD, RoHS, Tape and Reel; Manufacturer: Coilcraft; Case Width: 4.3mm; Case Height: 2.1mm; Maximum DC Current: 11A; Core Material: Composite; Test Frequency: 100kHz; Tolerance: 20%; Maximum DC Resistance: 11.9mOhms; Inductance: 1uH; Self Resonant Frequency: 64MHz; RoHS: Details; Series: XFL4020; Case Length: 4.3mm; Package Reference: XFL4020; Dimensions: 4.3mmWx4.3mmLx2.1mmH; Product: PowerInductors; Datasheet Version: 07/2012; Manufacturer URL: http://www.coilcraft.com/; Termination Style: SMD/SMT; Mounting Technology: SurfaceMount; Operating Temperature Range: -40Cto+125C; Package Description: 2-Pin Surface Mount Device, Body 4 x 4 mm, Pitch 2.37 mm; Shielding: Shielded; Packaging: Reel; Datasheet URL: http://www.mouser.com/ds/2/597/xfl4020-270756.pdf
L3 = CMP-02424-000022-1: Fixed Inductors Commercial Low DCR Series 10uH 2.2A 182.8mΩ 20%; Saturation Current: 2A; Shielding: Shielded; Self Resonant Frequency: 17MHz; Test Frequency: 100kHz; Core Material: Ferrite; DC Resistance (DCR): 182.8mR; Depth: 5.43mm; Current Rating: 2.2A; Min Operating Temperature: -55°C; Military Standard: Not; Max Operating Temperature: 125°C; Package Quantity: 2000; Number of Pins: 2020; Lead Free: Lead Free; Packaging: Tape and Reel; Tolerance: 20%; Radiation Hardening: No; Inductance Tolerance: 20%; Inductance: 10uH; Width: 0.204inch; Height: 2mm; Case/Package: 2020; Length: 5.49mm; Termination: SMD/SMT; RMS Current (Irms): 2.2A; Mount: Surface Mount; Height - Seated (Max): 0.079inch; Max DC Current: 2.2A
L4 = ETQ-P4M4R7YFP: Inductor; Manufacturer_Name: Panasonic; Datasheet Link: http://industrial.panasonic.com/cdbs/www-data/pdf/AGL0000/AGL0000C59.pdf; Height: 4mm; Manufacturer_Part_Number: ETQ-P4M4R7YFP; Mouser Part Number: 667-ETQ-P4M4R7YFP; Mouser Price/Stock: https://www.mouser.co.uk/ProductDetail/Panasonic/ETQ-P4M4R7YFP?qs=sL7MMaRBAPUkE7CwQl2wMA%3D%3D; Arrow Part Number: ETQ-P4M4R7YFP; Arrow Price/Stock: https://www.arrow.com/en/products/etq-p4m4r7yfp/panasonic?region=nac
LED1 = 19-217UYOC/S3112/TR8: Color: Amber; MPN: 19-217UYOC/S3112/TR8
LED2 LED4 = CMP-2100-03578-1: Chip LED, Red, 5 V, 25 mA, -40 to 85 degC, 2-Pin SMD (0603), RoHS, Tape and Reel; Manufacturer: Everlight Electronics; Manufacturer Part Number: 19-217/R6C-AL1M2VY/3T; Forward Voltage: 2.2V; Lens Style: Clear; Shape: Rectangular; Forward Current: 25mA; Luminous Intensity-Nom: 20mcd; Channels: 1; Optoelectronic Device Type: SINGLE COLOR LED; Viewing Angle: 120°; Overall Height: 0.4mm; Package Reference: 0603; Case/Package: 0603; RoHSCompliant: false; Package Description: 2-Pin Surface Mount Device, Body 1.6 x 0.8 mm; Colour: Red; Lead Free: LeadFree; Datasheet URL: https://datasheet.ciiva.com/4688/el-19-217-r6c-al1m2vy-3tpdf-187026-4688713.pdf; Manufacturer URL: http://www.everlight.com/; Datasheet Version: Rev. 1, 01/2005; Supplier: Digikey; Supplier Part Number: 1080-1585-6-ND; RoHS: Yes; Category: LEDs; Mounting Technology: Surface Mount; Pins: 2; Color: Red; Min Operating Temperature: -40°C; Max Operating Temperature: 85°C; Packaging: Tape and Reel; Size: 1mm; Terminal Pitch: 1.5mm; Reach SVHC Compliant: Yes; RoHS Compliant: Yes; ComponentLink1URL: https://datasheet.ciiva.com:443/pdfs/VipMasterIC/IC/EVER/EVER-S-A0007433843/EVER-S-A0007433843-1.pdf?src-supplier=IHS+Markit; ComponentLink1Description: https://datasheet.ciiva.com:443/pdfs/VipMasterIC/IC/EVER/EVER-S-A0007433843/EVER-S-A0007433843-1.pdf?src-supplier=IHS+Markit; ComponentLink2URL: https://media.digikey.com/pdf/Data%20Sheets/Everlight%20PDFs/19-217-R6C-AL1M2VY-3T.pdf?src-supplier=Digikey; ComponentLink2Description: https://media.digikey.com/pdf/Data%20Sheets/Everlight%20PDFs/19-217-R6C-AL1M2VY-3T.pdf?src-supplier=Digikey
LED3 = AP102-2020: DotStar Micro RGB; MPN: AP102-2020
Q1 = HP8KA1TB: MOSFET (N-Channel); Manufacturer_Name: ROHM Semiconductor; Datasheet Link: https://fscdn.rohm.com/en/products/databook/datasheet/discrete/transistor/mosfet/hp8ka1tb-e.pdf; Height: 1.1mm; Manufacturer_Part_Number: HP8KA1TB; Mouser Part Number: 755-HP8KA1TB; Mouser Price/Stock: https://www.mouser.co.uk/ProductDetail/ROHM-Semiconductor/HP8KA1TB?qs=npTsUczJOtPdLcGD1GKCyQ%3D%3D; Supplier 1: Mouser; Supplier Part Number 1: 755-HP8KA1TB
Q2 = RQ1E070RPTR: MOSFET (P-Channel); Manufacturer_Name: ROHM Semiconductor; Datasheet Link: https://fscdn.rohm.com/en/products/databook/datasheet/discrete/transistor/mosfet/rq1e070rp-e.pdf; Height: 0.85mm; Manufacturer_Part_Number: RQ1E070RPTR; Mouser Part Number: 755-RQ1E070RPTR; Mouser Price/Stock: https://www.mouser.co.uk/ProductDetail/ROHM-Semiconductor/RQ1E070RPTR?qs=IsRgwgmxh69DufX0QLYkBg%3D%3D; Supplier 1: Mouser; Supplier Part Number 1: 755-RQ1E070RPTR
Q3 = CMP-20235-000001-1: NPN TRANSISTOR 1.5A 40V SOT-23 R; Transition Frequency: 100MHz; Max Breakdown Voltage: 25V; Collector Emitter Voltage (VCEO): 400mV; Max Power Dissipation: 300mW; Max Collector Current: 1.5A; Case/Package: TO-236-3; Packaging: Tape and Reel; RoHS Compliant: Yes; Mount: Surface Mount; Collector Emitter Breakdown Voltage: 25V
Q4-Q6 = STL3N10F7: MOSFET (N-Channel); Manufacturer_Name: STMicroelectronics; Datasheet Link: https://www.st.com/resource/en/datasheet/stl3n10f7.pdf; Height: 0.8mm; Manufacturer_Part_Number: STL3N10F7; Mouser Part Number: 511-STL3N10F7; Mouser Price/Stock: https://www.mouser.co.uk/ProductDetail/STMicroelectronics/STL3N10F7?qs=DqCdCwOw4%2F7465H%2FZZJt7g%3D%3D
R1 R3 R4 R12-R14 R22 R24 R30 R45 = CMP-009-00138-3: Chip Resistor, 10 kOhms, +/-5 %, 63 mW, -55 to 155 degC, 0402; Tolerance: 5%; Power: 63mW; Max Operating Temperature: 155°C; Pins: 2; Value: 10k; Min Operating Temperature: -55°C; Case/Package: 0402
R2 = CMP-009-00138-3: Chip Resistor, 20 kOhms, +/-5 %, 63 mW, -55 to 155 degC, 0402; Value: 20k; Tolerance: 5%; Power: 63mW; Max Operating Temperature: 155°C; Pins: 2; Min Operating Temperature: -55°C; Case/Package: 0402
R5 = CMP-009-00138-3: Chip Resistor, NC, +/-5 %, 63 mW, -55 to 155 degC, 0402; Tolerance: 5%; Power: 63mW; Max Operating Temperature: 155°C; Pins: 2; Value: NC; Min Operating Temperature: -55°C; Case/Package: 0402
R6-R8 = CMP-009-00138-3: Chip Resistor, 180 kOhms, +/-5 %, 63 mW, -55 to 155 degC, 0402; Tolerance: 5%; Power: 63mW; Max Operating Temperature: 155°C; Pins: 2; Value: 180k; Min Operating Temperature: -55°C; Case/Package: 0402
R9 = CMP-009-00138-3: Chip Resistor, 1 MOhms, +/-5 %, 63 mW, -55 to 155 degC, 0402; Tolerance: 5%; Power: 63mW; Max Operating Temperature: 155°C; Pins: 2; Value: 1M; Min Operating Temperature: -55°C; Case/Package: 0402
R10 = CMP-009-00138-3: Chip Resistor, 5.3 kOhms, +/-5 %, 63 mW, -55 to 155 degC, 0402; Tolerance: 5%; Power: 63mW; Max Operating Temperature: 155°C; Pins: 2; Value: 5.3k; Min Operating Temperature: -55°C; Case/Package: 0402
R11 R20 = CMP-009-00138-3: Chip Resistor, 40 kOhms, +/-5 %, 63 mW, -55 to 155 degC, 0402; Value: 40k; Tolerance: 5%; Power: 63mW; Max Operating Temperature: 155°C; Pins: 2; Min Operating Temperature: -55°C; Case/Package: 0402
R15 R44 = CMP-009-00138-3: Chip Resistor, 0 Ohms, +/-5 %, 63 mW, -55 to 155 degC, 0402; Tolerance: 5%; Power: 63mW; Max Operating Temperature: 155°C; Pins: 2; Value: 0R; Min Operating Temperature: -55°C; Case/Package: 0402
R16-R18 = CMP-009-00138-3: Chip Resistor, 39 kOhms, +/-5 %, 63 mW, -55 to 155 degC, 0402; Tolerance: 5%; Power: 63mW; Max Operating Temperature: 155°C; Pins: 2; Value: 39k; Min Operating Temperature: -55°C; Case/Package: 0402
R19 R37 = CMP-009-00138-3: Chip Resistor, 30.9 kOhms, +/-5 %, 63 mW, -55 to 155 degC, 0402; Tolerance: 5%; Power: 63mW; Max Operating Temperature: 155°C; Pins: 2; Value: 30.9k; Min Operating Temperature: -55°C; Case/Package: 0402
R21 R26 R28 R38 R39 = CMP-009-00138-3: Chip Resistor, 1 kOhms, +/-5 %, 63 mW, -55 to 155 degC, 0402; Tolerance: 5%; Power: 63mW; Max Operating Temperature: 155°C; Pins: 2; Value: 1k; Min Operating Temperature: -55°C; Case/Package: 0402
R23 R27 R32 = R0402: Height: 0.4mm
R25 = CMP-009-00138-3: Chip Resistor, 1.15 MOhms, +/-5 %, 63 mW, -55 to 155 degC, 0402; Tolerance: 5%; Power: 63mW; Max Operating Temperature: 155°C; Pins: 2; Value: 1.15M; Min Operating Temperature: -55°C; Case/Package: 0402
R29 = CMP-009-00138-3: Chip Resistor, 205 kOhms, +/-5 %, 63 mW, -55 to 155 degC, 0402; Tolerance: 5%; Power: 63mW; Max Operating Temperature: 155°C; Pins: 2; Value: 205k; Min Operating Temperature: -55°C; Case/Package: 0402
R31 = CMP-02407-004199-1: RES Thick Film, 5.49Ω, 1%, 1W, 100ppm/°C, 2512; MPN: HoAR2512-1W-5R-0.1%-TCR25; Voltage Rating: 500V; Case Code (Metric): 6432; Temperature Coefficient: 100ppm/°C; Weight: 0.001429oz; Radiation Hardening: No; Voltage Rating (DC): 500V; Case Code (Imperial): 2512; Length: 6.3mm; Number of Pins: 2; Military Standard: Not; Packaging: Tape and Reel; Contact Plating: Tin; Width: 3.15mm; Lead Free: Lead Free; Package Quantity: 2000; Composition: Thick Film; Termination: SMD/SMT; Number of Terminations: 2; Features: Automotive AEC-Q200; Max Power Dissipation: 1W; Case/Package: 2512; Min Operating Temperature: -55°C; Depth: 3.15mm; Max Operating Temperature: 155°C; Tolerance: 1%; Power Rating: 1W; Height: 0.6mm; Resistance: 5R; Supplier: LCSC
R33 R41 = CMP-009-00138-3: Chip Resistor, 10 Ohms, +/-5 %, 63 mW, -55 to 155 degC, 0402; Tolerance: 5%; Power: 63mW; Max Operating Temperature: 155°C; Pins: 2; Value: 10R; Min Operating Temperature: -55°C; Case/Package: 0402
R34 = CMP-009-00138-3: Chip Resistor, 100 kOhms, +/-5 %, 63 mW, -55 to 155 degC, 0402; Tolerance: 5%; Power: 63mW; Max Operating Temperature: 155°C; Pins: 2; Value: 100k; Min Operating Temperature: -55°C; Case/Package: 0402
R35 = CMP-009-00138-3: Chip Resistor, 150 kOhms, +/-5 %, 63 mW, -55 to 155 degC, 0402; Tolerance: 5%; Power: 63mW; Max Operating Temperature: 155°C; Pins: 2; Value: 150k; Min Operating Temperature: -55°C; Case/Package: 0402
R36 = CMP-009-00138-3: Chip Resistor, 15 kOhms, +/-5 %, 63 mW, -55 to 155 degC, 0402; Tolerance: 5%; Power: 63mW; Max Operating Temperature: 155°C; Pins: 2; Value: 15k; Min Operating Temperature: -55°C; Case/Package: 0402
R40 = CMP-009-00025-5: Chip Resistor, 10 mOhm, +/- 1%, 0.25 W, -55 to 155 degC, 1206 (3216 Metric); Voltage Rating: 200V; RoHS Compliant: True; Max Operating Temperature: 155°C; Value: 10m 1W; Pins: 2; Tolerance: 1%; Mounting Technology: SM; Case/Package: 1206; Min Operating Temperature: -55°C; Power: 1W
R42 = CMP-009-00138-3: Chip Resistor, 330 Ohms, +/-5 %, 63 mW, -55 to 155 degC, 0402; Tolerance: 5%; Power: 63mW; Max Operating Temperature: 155°C; Pins: 2; Value: 330R; Min Operating Temperature: -55°C; Case/Package: 0402
R43 = CMP-009-00138-3: Chip Resistor, 49.9 kOhms, +/-5 %, 63 mW, -55 to 155 degC, 0402; Tolerance: 5%; Power: 63mW; Max Operating Temperature: 155°C; Pins: 2; Value: 49.9k; Min Operating Temperature: -55°C; Case/Package: 0402
R46 = CMP-009-00138-3: Chip Resistor, 1.5 kOhms, +/-5 %, 63 mW, -55 to 155 degC, 0402; Tolerance: 5%; Power: 63mW; Max Operating Temperature: 155°C; Pins: 2; Value: 1.5k; Min Operating Temperature: -55°C; Case/Package: 0402
SW1 = APTCLGTVTR: Switch; Manufacturer_Name: Apem; Datasheet Link: https://media.digikey.com/pdf/Data%20Sheets/APEM%20Components%20PDFs/APTCLGTV.pdf; Height: 1.87mm; Manufacturer_Part_Number: APTCLGTVTR; Mouser Part Number: 642-APTCLGTVTR; Mouser Price/Stock: https://www.mouser.co.uk/ProductDetail/Apem/APTCLGTVTR?qs=ikKlZSMjbcRNf%252Bwzp31ctg%3D%3D
SW2 = MK-11C04-G013: SPDT 1A 6V Slide Switch; Supplier 1: LCSC; Supplier Part Number 1: C778185
SW3 = CMP-2100-03586-2: LCSC SWITCH TACTILE SPST-NO 0.05A 12V; Contact Resistance: 100mR; Operating Force: 1.5N; Max Current Rating: 50mA; Switch Travel: 0.15mm; Actuator Type: Standard; Mechanical Life: 200000Cycles; Ratings: Dust Proof; Illumination Type: Non-Illuminated; Throw Configuration: SPST; Actuator Length: 0.4mm; Switch Function: Off-Mom; Height: 1.2mm; Width: 3mm; Weight: 0.000776oz; Contact Material: Silver; Max Voltage Rating (DC): 12V; Insulation Resistance: 100MR; Lead Free: Lead Free; Current Rating: 50mA; Termination: SMD/SMT; Length: 4mm; Voltage Rating (DC): 12V; Contact Current Rating: 50mA; Orientation: Straight; Depth: 2.5mm; Max Operating Temperature: 70°C; Packaging: Tape and Reel; Min Operating Temperature: -25°C; Package Quantity: 1; Mount: Surface Mount; Electrical Life: 200000Cycles
TP1-TP14 = TestPoint
U1 = BQ25303JRTER: Integrated Circuit; Manufacturer_Name: Texas Instruments; Datasheet Link: https://www.ti.com/lit/ds/symlink/bq25303j.pdf?ts=1614639374775&ref_url=https%253A%252F%252Fwww.ti.com%252Fpower-management%252Fbattery-management%252Fcharger-ics%252Fproducts.html; Height: 0.8mm; Manufacturer_Part_Number: BQ25303JRTER; Mouser Part Number: 595-BQ25303JRTER; Mouser Price/Stock: https://www.mouser.co.uk/ProductDetail/Texas-Instruments/BQ25303JRTER?qs=DRkmTr78QARA1C7%2F12q3og%3D%3D; Arrow Part Number: BQ25303JRTER; Arrow Price/Stock: https://www.arrow.com/en/products/bq25303jrter/texas-instruments?region=nac; Supplier 1: Mouser; Supplier Part Number 1: 595-BQ25303JRTER
U2 = XC6136N35BNR-G: Integrated Circuit; Manufacturer_Name: Torex; Datasheet Link: https://www.torexsemi.com/file/xc6136/XC6136.pdf; Height: 1.1mm; Manufacturer_Part_Number: XC6136N35BNR-G; Mouser Part Number: 865-XC6136N35BNR-G; Mouser Price/Stock: https://www.mouser.co.uk/ProductDetail/Torex-Semiconductor/XC6136N35BNR-G?qs=T3oQrply3y%252BoEyjYGdDjug%3D%3D; Supplier 1: Mouser; Supplier Part Number 1: 865-XC6136N35BNR-G
U3 = TPS25730SRSMR: Integrated Circuit; Manufacturer_Name: Texas Instruments; Datasheet Link: https://www.ti.com/lit/gpn/tps25730; Height: 1mm; Manufacturer_Part_Number: TPS25730SRSMR; Mouser Part Number: 595-TPS25730SRSMR; Mouser Price/Stock: https://www.mouser.co.uk/ProductDetail/Texas-Instruments/TPS25730SRSMR?qs=Z%252BL2brAPG1I6BwfkKI1wWQ%3D%3D; Supplier 1: Mouser; Supplier Part Number 1: 595-TPS25730SRSMR
U4 = TPS63060DSCR: Integrated Circuit; Manufacturer_Name: Texas Instruments; Datasheet Link: http://www.ti.com/lit/gpn/tps63060; Height: 0.8mm; Manufacturer_Part_Number: TPS63060DSCR; Mouser Part Number: 595-TPS63060DSCR; Mouser Price/Stock: https://www.mouser.co.uk/ProductDetail/Texas-Instruments/TPS63060DSCR?qs=3jfYfyvUSwA68pYl7mRJ2w%3D%3D; Arrow Part Number: TPS63060DSCR; Arrow Price/Stock: https://www.arrow.com/en/products/tps63060dscr/texas-instruments?region=nac; Supplier 1: Mouser; Supplier Part Number 1: 595-TPS63060DSCR
U5 = CMP-0388-00237-2: High Brightness White LED Driver, 3 to 18 V, -40 to 85 degC, 6-pin SON (DRV6), Green (RoHS & no Sb/Br); Manufacturer: Texas Instruments; Dimming: TRUE; Topology: Boost; Rating: Catalog; Iq(Typ)(mA): 1.5; Switching Frequency(Max)(kHz): 1200; Vin(Max)(V): 18; Vin(Min)(V): 3; PackageReference: DRV0006A; PackageVersion: 4206925/E; PartNumber: TPS61165DRVR; ComponentLink3Description: Package Specification; ComponentLink2Description: Datasheet; Eco-Plan: Green (RoHS & no Sb/Br); DatasheetVersion: SLVS790B; ComponentLink1URL: http://www.ti.com/; ComponentLink2URL: http://www.ti.com/general/docs/lit/getliterature.tsp?genericPartNumber=TPS61165&fileType=pdf; PackageDescription: 6-Pin Plastic Small Outline No-Lead, Body 2 x 2 mm, Pitch 0.65 mm; ComponentLink1Description: Manufacturer URL; Mounting Technology: Surface Mount; ComponentLink3URL: http://www.ti.com/litv/pdf/mpds216d; Synchronous Rectification: TRUE; SubFamily: White LED Driver
U6 = TPS552892QWRYQRQ1: Integrated Circuit; Manufacturer_Name: Texas Instruments; Datasheet Link: https://www.ti.com/general/docs/suppproductinfo.tsp?distId=26&gotoUrl=https://www.ti.com/lit/gpn/tps552892-q1; Height: 1mm; Manufacturer_Part_Number: TPS552892QWRYQRQ1; Mouser Part Number: 595-PS552892QWRYQRQ1; Mouser Price/Stock: https://www.mouser.co.uk/ProductDetail/Texas-Instruments/TPS552892QWRYQRQ1?qs=ulEaXIWI0c%2Fb5I1dUhUhNg%3D%3D; Supplier 1: Mouser; Supplier Part Number 1: 595-PS552892QWRYQRQ1
U7 = ATSAMD21E18A-MUT: Integrated Circuit; Manufacturer_Name: Microchip; Datasheet Link: https://mouser.componentsearchengine.com/Datasheets/5/ATSAMD21E18A-MUT.pdf; Height: 0.9mm; Manufacturer_Part_Number: ATSAMD21E18A-MUT; Mouser Part Number: 556-ATSAMD21E18A-MUT; Mouser Price/Stock: https://www.mouser.co.uk/ProductDetail/Microchip-Technology/ATSAMD21E18A-MUT?qs=KLFHFgXTQiBWo%2Fq3Hj2bxw%3D%3D; Arrow Part Number: ATSAMD21E18A-MUT; Arrow Price/Stock: https://www.arrow.com/en/products/atsamd21e18a-mut/microchip-technology?region=nac; Supplier 1: Mouser; Supplier Part Number 1: 556-ATSAMD21E18A-MUT
U8 = CMP-04917-000186-1: IC REG LINEAR 3.3V 1A 6WSON; Dropout Voltage: 475mV; Number of Regulators: 1; Output Configuration: Positive; Power Supply Rejection Ratio (PSRR): 52dB; Output Type: Fixed; Max Input Voltage: 5.5V; Max Supply Current: 40uA; Min Output Voltage: 3.3V; Output Current: 1A; Max Operating Temperature: 125°C; Mount: Surface Mount; Min Operating Temperature: -40°C; Packaging: Cut Tape; RoHS Compliant: Yes
U9 = ME6211C33M5G-N: LCSC +3.3V LDO 500mA VDIF=120mV@100mA
U10 = TPS7A4700RGWR: Integrated Circuit; Manufacturer_Name: Texas Instruments; Datasheet Link: http://www.ti.com/lit/gpn/tps7a47; Height: 1mm; Manufacturer_Part_Number: TPS7A4700RGWR; Mouser Part Number: 595-TPS7A4700RGWR; Mouser Price/Stock: https://www.mouser.co.uk/ProductDetail/Texas-Instruments/TPS7A4700RGWR?qs=b5Ofe9I6AaEq0TfoG6v9lA%3D%3D; Arrow Part Number: TPS7A4700RGWR; Arrow Price/Stock: https://www.arrow.com/en/products/tps7a4700rgwr/texas-instruments?region=nac; Supplier 1: Mouser; Supplier Part Number 1: 595-TPS7A4700RGWR